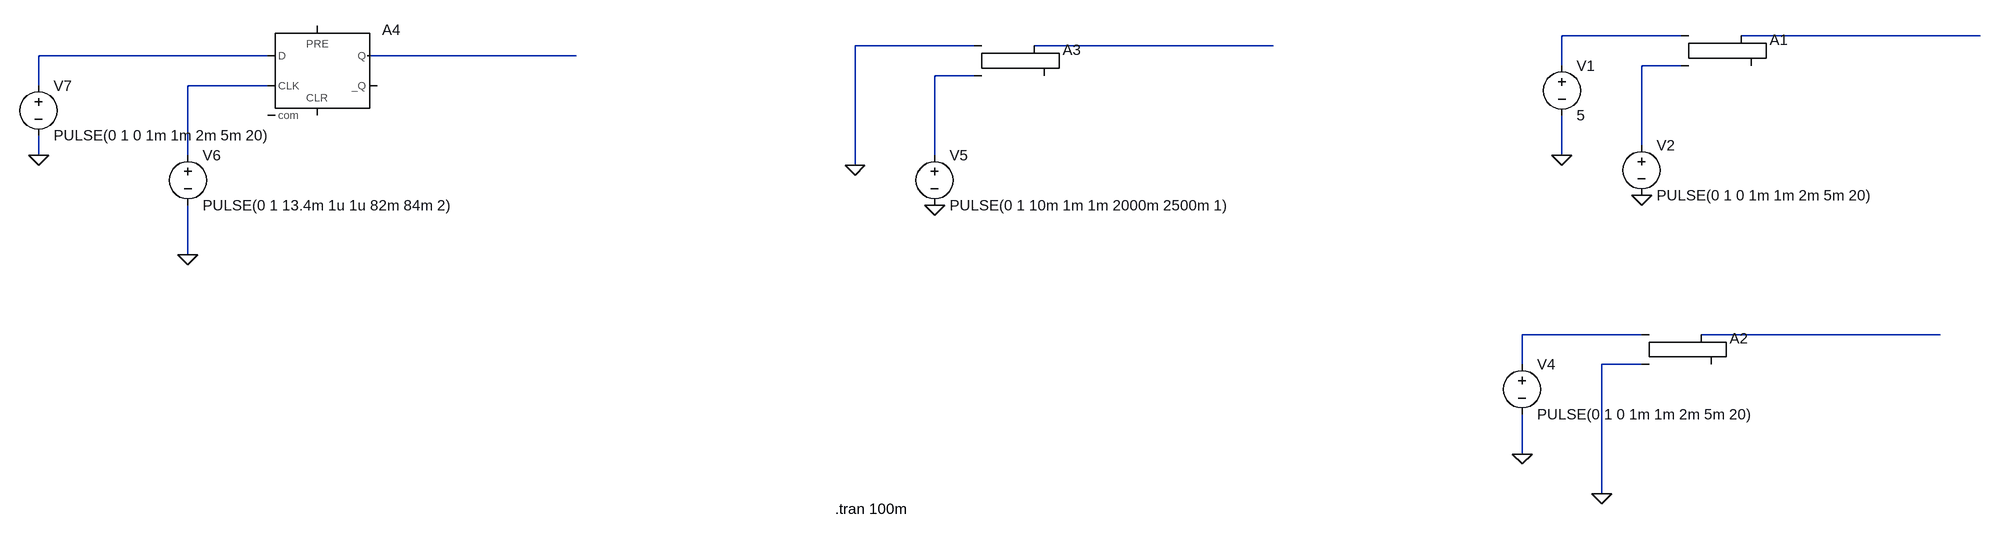
[diagram p0: schematic SR Flop Circuit Test.asc]
SR Flop Circuit Test.asc, the LTspice schematic file:
Version 4.1
SHEET 1 880 920
WIRE 208 144 16 144
WIRE 688 144 304 144
WIRE -928 160 -1120 160
WIRE -448 160 -832 160
WIRE -2064 176 -2432 176
WIRE -1568 176 -1904 176
WIRE 16 192 16 144
WIRE 208 192 144 192
WIRE -928 208 -992 208
WIRE -2432 224 -2432 176
WIRE -2064 224 -2192 224
WIRE 144 320 144 192
WIRE -2432 336 -2432 304
WIRE -2192 336 -2192 224
WIRE -992 336 -992 208
WIRE 16 336 16 272
WIRE -1120 352 -1120 160
WIRE -2192 496 -2192 416
WIRE 144 624 -48 624
WIRE 624 624 240 624
WIRE -48 672 -48 624
WIRE 144 672 80 672
WIRE -48 816 -48 752
WIRE 80 880 80 672
FLAG 16 336 0
FLAG 144 400 0
FLAG -48 816 0
FLAG 80 880 0
FLAG -1120 352 0
FLAG -992 416 0
FLAG -2432 336 0
FLAG -2192 496 0
SYMBOL Digital\\srflop 256 96 R0
SYMATTR InstName A1
SYMBOL voltage 16 176 R0
WINDOW 123 0 0 Left 0
WINDOW 39 0 0 Left 0
SYMATTR InstName V1
SYMATTR Value 5
SYMBOL voltage 144 304 R0
WINDOW 123 0 0 Left 0
WINDOW 39 0 0 Left 0
SYMATTR InstName V2
SYMATTR Value PULSE(0 1 0 1m 1m 2m 5m 20)
SYMBOL Digital\\srflop 192 576 R0
SYMATTR InstName A2
SYMBOL voltage -48 656 R0
WINDOW 123 0 0 Left 0
WINDOW 39 0 0 Left 0
SYMATTR InstName V4
SYMATTR Value PULSE(0 1 0 1m 1m 2m 5m 20)
SYMBOL Digital\\srflop -880 112 R0
SYMATTR InstName A3
SYMBOL voltage -992 320 R0
WINDOW 123 0 0 Left 0
WINDOW 39 0 0 Left 0
SYMATTR InstName V5
SYMATTR Value PULSE(0 1 10m 1m 1m 2000m 2500m 1)
SYMBOL Digital\\dflop -1984 128 R0
SYMATTR InstName A4
SYMBOL voltage -2192 320 R0
WINDOW 123 0 0 Left 0
WINDOW 39 0 0 Left 0
SYMATTR InstName V6
SYMATTR Value PULSE(0 1 13.4m 1u 1u 82m 84m 2)
SYMBOL voltage -2432 208 R0
WINDOW 123 0 0 Left 0
WINDOW 39 0 0 Left 0
SYMATTR InstName V7
SYMATTR Value PULSE(0 1 0 1m 1m 2m 5m 20)
TEXT -1152 904 Left 2 !.tran 100m

The netlist it stands for:
* SR Flop Circuit Test.asc
A1 N001 N006 0 0 0 0 N002 0 SRFLOP
V1 N001 0 5
V2 N006 0 PULSE(0 1 0 1m 1m 2m 5m 20)
A2 N009 0 0 0 0 0 N010 0 SRFLOP
V4 N009 0 PULSE(0 1 0 1m 1m 2m 5m 20)
A3 0 N007 0 0 0 0 N003 0 SRFLOP
V5 N007 0 PULSE(0 1 10m 1m 1m 2000m 2500m 1)
A4 N004 0 N008 0 0 0 N005 0 DFLOP
V6 N008 0 PULSE(0 1 13.4m 1u 1u 82m 84m 2)
V7 N004 0 PULSE(0 1 0 1m 1m 2m 5m 20)
.tran 100m
.backanno
.end